# Altium project AmpClick.PrjPcb
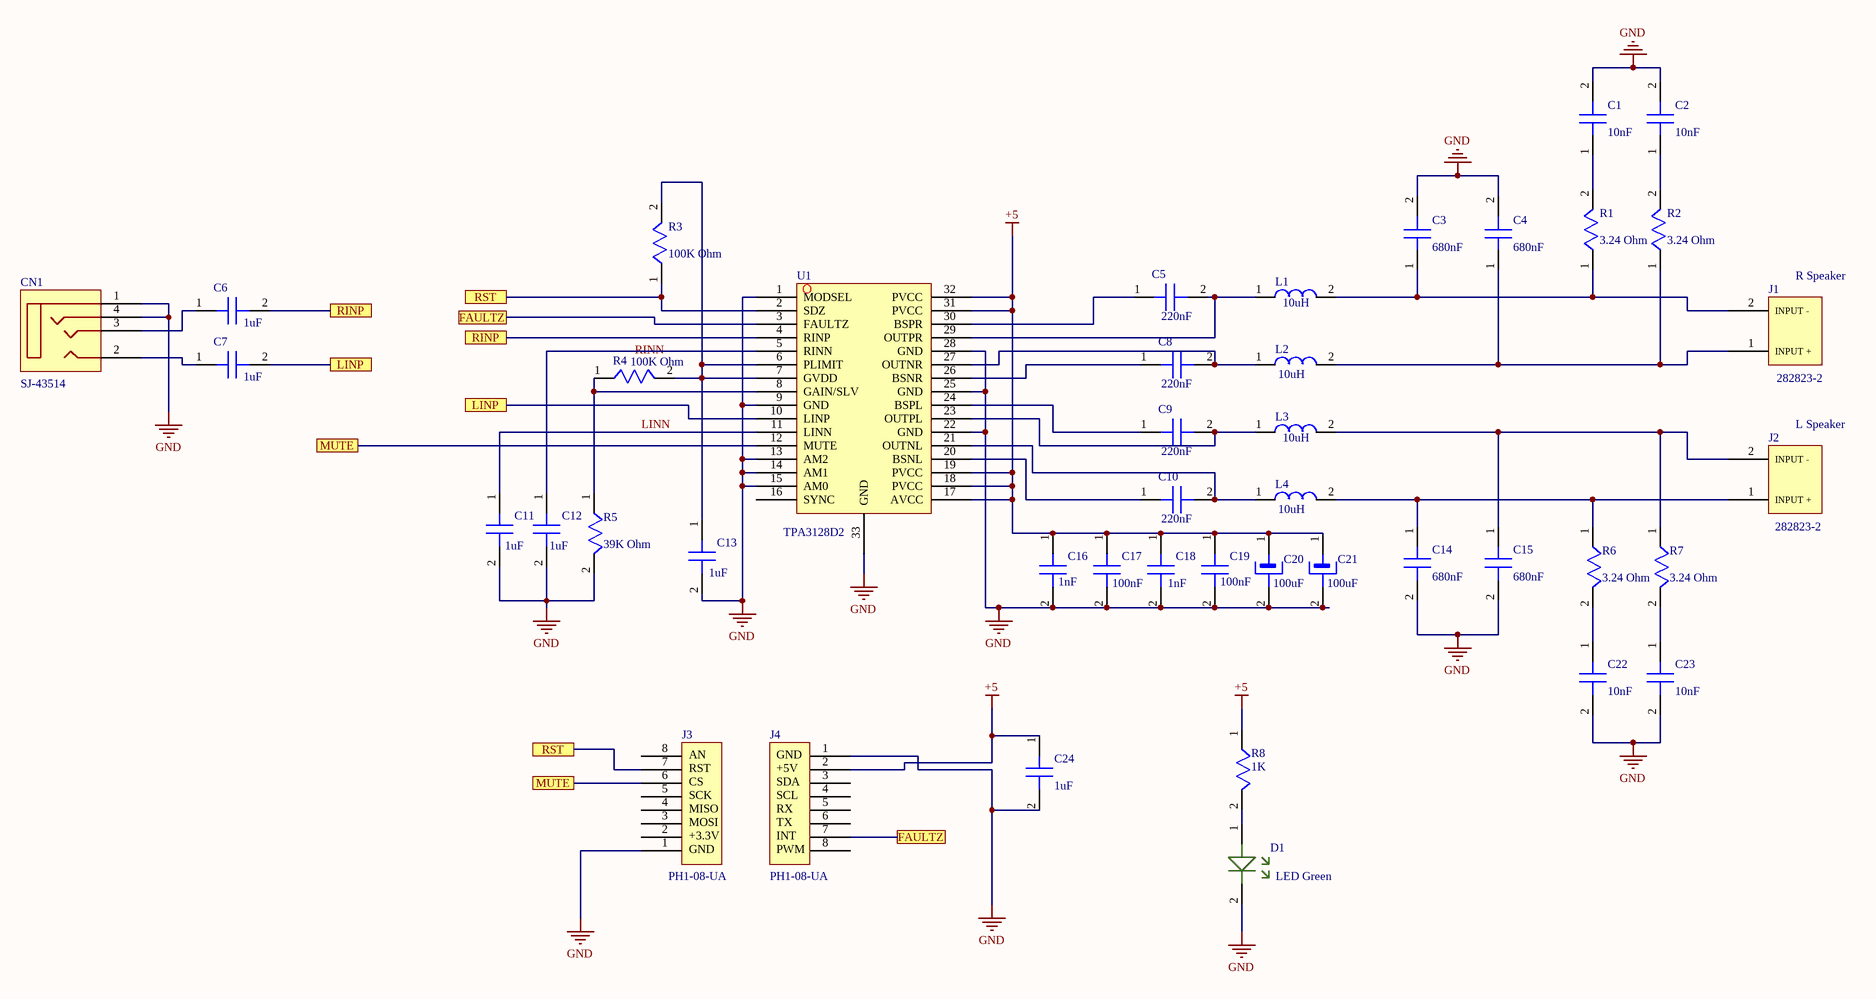
[diagram p0: AmpClickShematic.SchDoc]
1 sheet, 43 parts. Net scope: flat (ports and power ports of the same name join across sheets).
Board files: AmpClick.PcbDoc, AmpClick2.PcbDoc

## Sheet AmpClickShematic.SchDoc
size A2; SheetNumber: 1; SheetTotal: 1

### Parts
C1  10nF  [CAP 10nF]
C2  10nF  [CAP 10nF]
C3  680nF  [CAP 680nF]
C4  680nF  [CAP 680nF]
C5  220nF  [CAP 220nF]
C6  1uF  [CAP 1uF]
C7  1uF  [CAP 1uF]
C8  220nF  [CAP 220nF]
C9  220nF  [CAP 220nF]
C10  220nF  [CAP 220nF]
C11  1uF  [CAP 1uF]
C12  1uF  [CAP 1uF]
C13  1uF  [CAP 1uF]
C14  680nF  [CAP 680nF]
C15  680nF  [CAP 680nF]
C16  1nF  [CAP 1nF]
C17  100nF  [CAP 100nF]
C18  1nF  [CAP 1nF]
C19  100nF  [CAP 100nF]
C20  100uF  [CAP ALUM 100uF]
C21  100uF  [CAP ALUM 100uF]
C22  10nF  [CAP 10nF]
C23  10nF  [CAP 10nF]
C24  1uF  [CAP 1uF]
CN1  Name: SJ-43514  [Audio Jack]  (hidden comment: Audio Jack)
D1  Green  [LED Green]  (value not drawn)
J1  R Speaker  Name: 282823-2  [2P CONN 2.54mm]
J2  L Speaker  Name: 282823-2  [2P CONN 2.54mm]
J3  Name: PH1-08-UA  [8POS HEADER]  (hidden comment: 8P HEADER)
J4  Name: PH1-08-UA  [8POS HEADER]  (hidden comment: 8P HEADER)
L1  value 10uH  [Power Inductor]  (hidden comment: Power Inductor 10uH)
L2  value 10uH  [Power Inductor]  (hidden comment: Power Inductor 10uH)
L3  value 10uH  [Power Inductor]  (hidden comment: Power Inductor 10uH)
L4  value 10uH  [Power Inductor]  (hidden comment: Power Inductor 10uH)
R1  value 3.24 Ohm  [SMD RES 3.24ohm]  (hidden comment: 3.24ohm)
R2  value 3.24 Ohm  [SMD RES 3.24ohm]  (hidden comment: 3.24ohm)
R3  value 100K Ohm  [SMD RES 100K]  (hidden comment: 100K)
R4  value 100K Ohm  [SMD RES 100K]  (hidden comment: 100K)
R5  value 39K Ohm  [SMD RES 39K]  (hidden comment: SMD RES 39K)
R6  value 3.24 Ohm  [SMD RES 3.24ohm]  (hidden comment: 3.24ohm)
R7  value 3.24 Ohm  [SMD RES 3.24ohm]  (hidden comment: 3.24ohm)
R8  1K  [SMD RES 1K]
U1  Name: TPA3128D2  [TPA 30W AMP.]  (hidden comment: TPA 30W AMP.)

### Ports
FAULTZ, LINP, MUTE, RINP, RST

### Nets
+5: C16.1(PVCC) C17.1(PVCC) C18.1(PVCC) C19.1(PVCC) C20.1(PVCC) C21.1(PVCC) C24.1(PVCC) J4.2 R8.1 U1.17(AVCC) U1.18(PVCC) U1.19(PVCC) U1.31(PVCC) U1.32(PVCC)
GND: C1.2(PVCC) C2.2(PVCC) C3.2(PVCC) C4.2(PVCC) C11.2(PVCC) C12.2(PVCC) C13.2(PVCC) C14.2(PVCC) C15.2(PVCC) C16.2(PVCC) C17.2(PVCC) C18.2(PVCC) C19.2(PVCC) C20.2(PVCC) C21.2(PVCC) C22.2(PVCC) C23.2(PVCC) C24.2(PVCC) CN1.1 CN1.4 D1.2(PVCC) J3.1 J4.1 R5.2 U1.1(MODSEL) U1.9(GND) U1.13(AM2) U1.14(AM1) U1.15(AM0) U1.22(GND) U1.25(GND) U1.28(GND) U1.33(GND)
NetC1_1: C1.1(PVCC) R1.2
NetC2_1: C2.1(PVCC) R2.2
NetC3_1: C3.1(PVCC) J1.2(INPUT_-) L1.2 R1.1
NetC4_1: C4.1(PVCC) J1.1(INPUT_+) L2.2 R2.1
NetC5_1: C5.1(PVCC) U1.30(BSPR)
NetC5_2: C5.2(PVCC) L1.1 U1.29(OUTPR)
NetC6_1: C6.1(PVCC) CN1.3
NetC6_2: C6.2(PVCC) U1.4(RINP) ; port RINP
NetC7_1: C7.1(PVCC) CN1.2
NetC7_2: C7.2(PVCC) U1.10(LINP) ; port LINP
NetC8_1: C8.1(PVCC) U1.26(BSNR)
NetC8_2: C8.2(PVCC) L2.1 U1.27(OUTNR)
NetC9_1: C9.1(PVCC) U1.24(BSPL)
NetC9_2: C9.2(PVCC) L3.1 U1.23(OUTPL)
NetC10_1: C10.1(PVCC) U1.20(BSNL)
NetC10_2: C10.2(PVCC) L4.1 U1.21(OUTNL)
NetC11_1: C11.1(PVCC) U1.11(LINN)
NetC12_1: C12.1(PVCC) U1.5(RINN)
NetC13_1: C13.1(PVCC) R3.2 R4.2 U1.6(PLIMIT) U1.7(GVDD)
NetC14_1: C14.1(PVCC) J2.1(INPUT_+) L4.2 R6.1
NetC15_1: C15.1(PVCC) J2.2(INPUT_-) L3.2 R7.1
NetC22_1: C22.1(PVCC) R6.2
NetC23_1: C23.1(PVCC) R7.2
NetD1_1: D1.1(PVCC) R8.2
NetJ3_6: J3.6 U1.12(MUTE) ; port MUTE
NetJ3_7: J3.7 R3.1 U1.2(SDZ) ; port RST
NetJ4_7: J4.7 U1.3(FAULTZ) ; port FAULTZ
NetR4_1: R4.1 R5.1 U1.8(GAIN/SLV)

Not connected (* = marked no-connect by the designer): J3 2(6) 3(7) 4(8) 5(9) 8(12); J4 3(7) 4(8) 5(9) 6(10) 8(12); U1 16(SYNC)

### Notes on the sheet
- (near R4) RINN
- (near R4) LINN
- (near J3) AN
- (near J3) RST
- (near J4) GND
- (near J4) +5V
- (near J3) CS
- (near J3) SCK
- (near J3) MISO
- (near J3) MOSI
- (near J4) SDA
- (near J4) SCL
- (near J4) RX
- (near J4) TX
- (near J3) +3.3V
- (near J3) GND
- (near J4) INT
- (near J4) PWM

### Library data of the parts
C1 C2 C22 C23 = CAP 10nF: Value: 10nF
C3 C4 C14 C15 = CAP 680nF: Value: 680nF
C5 C8-C10 = CAP 220nF: Value: 220nF
C6 C7 C11-C13 C24 = CAP 1uF: Value: 1uF
C16 C18 = CAP 1nF: Value: 1nF
C17 C19 = CAP 100nF: Value: 100nF
C20 C21 = CAP ALUM 100uF: Value: 100uF
D1 = LED Green: Name: LED Green
J1 J2 = 2P CONN
J3 J4 = 8P HEADER: 8 Position Header
R1 R2 R6 R7 = SMD RES 3.24OHM
R3 R4 = SMD RES 100K
R8 = SMD RES 1K
U1 = TPA 30W AMP.: TPA 2x30W IC